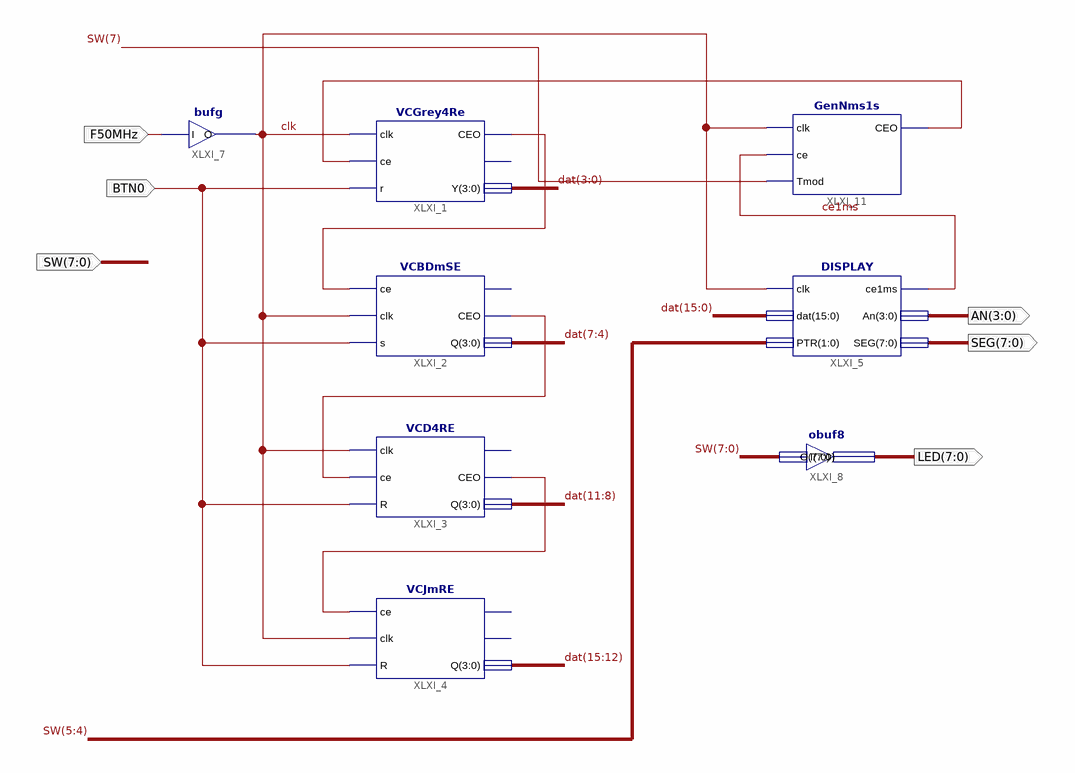
[diagram p0: schematic sheet 1]
// Xilinx ISE schematic Sch1_lab401.sch (spartan3e) as structural Verilog: 8 symbols, 6 ports
module Sch1_lab401 (
  input  F50MHz,
  input  BTN0,
  input  [7:0] SW,
  output [7:0] LED,
  output [3:0] AN,
  output [7:0] SEG
);

  wire ce1ms, CEO4, clk, XLXN_1, XLXN_2, XLXN_3;
  wire [15:0] dat;

  VCGrey4Re XLXI_1 (.clk(clk), .ce(CEO4), .r(BTN0), .CEO(XLXN_1), .Y(dat[3:0]));  // open: TC
  VCBDmSE XLXI_2 (.ce(XLXN_1), .clk(clk), .s(BTN0), .CEO(XLXN_2), .Q(dat[7:4]));  // open: TC
  VCD4RE XLXI_3 (.clk(clk), .ce(XLXN_2), .R(BTN0), .CEO(XLXN_3), .Q(dat[11:8]));  // open: TC
  VCJmRE XLXI_4 (.ce(XLXN_3), .clk(clk), .R(BTN0), .Q(dat[15:12]));  // open: TC, CEO
  DISPLAY XLXI_5 (.clk(clk), .dat(dat), .PTR(SW[5:4]), .ce1ms(ce1ms), .An(AN), .SEG(SEG));
  bufg XLXI_7 (.I(F50MHz), .O(clk));
  obuf8 XLXI_8 (.I(SW), .O(LED));
  GenNms1s XLXI_11 (.clk(clk), .ce(ce1ms), .Tmod(SW[7]), .CEO(CEO4));
endmodule
